# Altium schematic sheet Sheet1.SchDoc
size A3; SheetNumber: 1; SheetTotal: 1
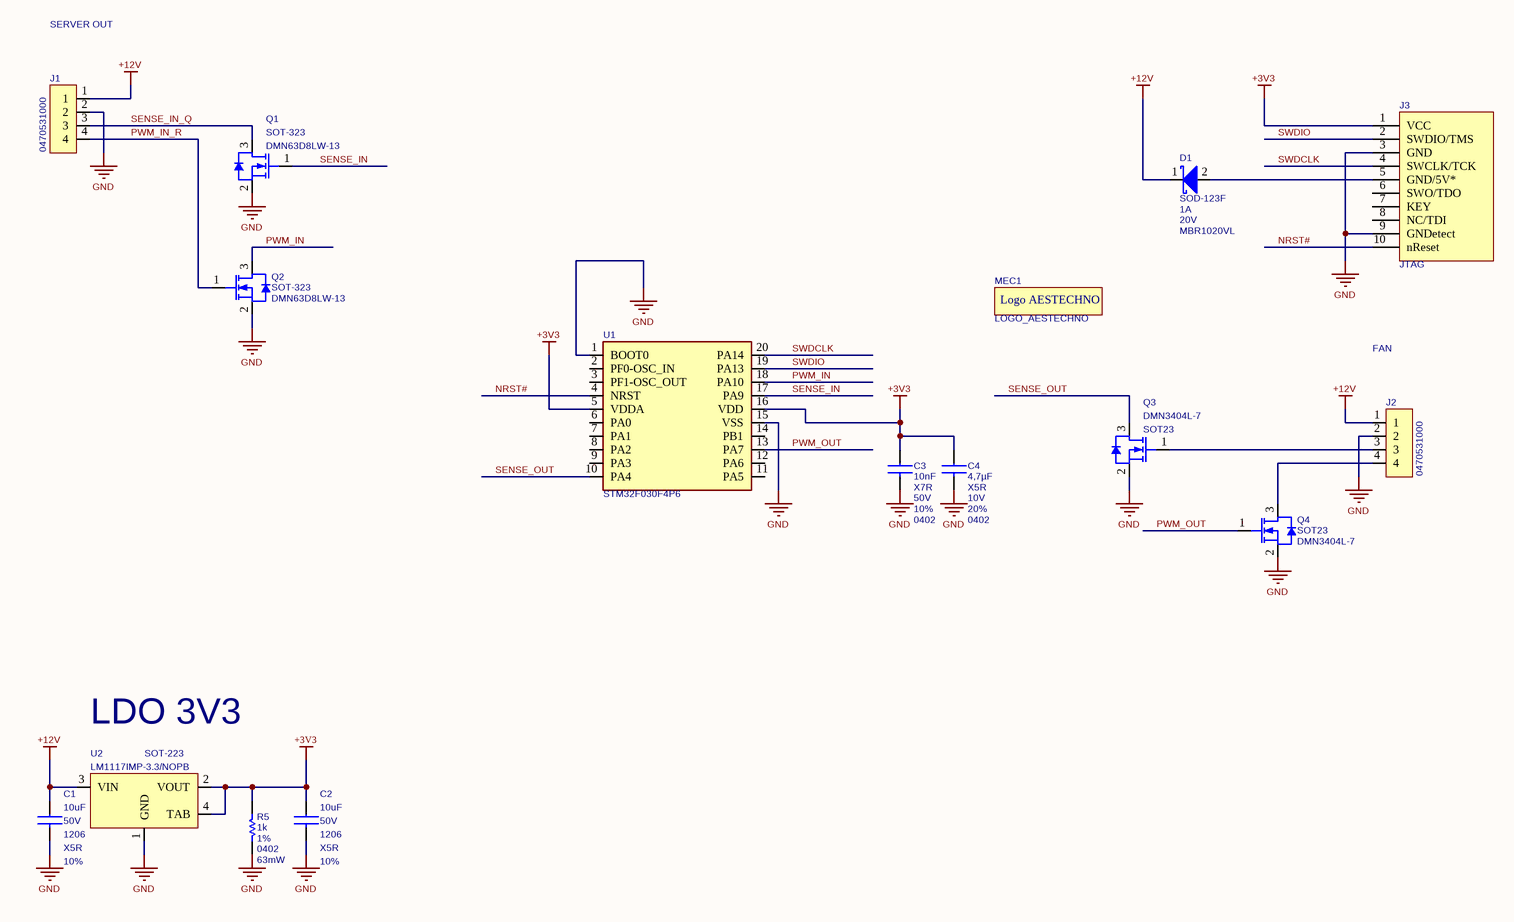
[diagram p0: Sheet1.SchDoc]

## Parts
C1  10uF  Tolerance: 10%  Voltage Rating: 50V  Dielectric: X5R  Case/Package: 1206  [CAP_1206_180_M]
C2  10uF  Tolerance: 10%  Voltage Rating: 50V  Dielectric: X5R  Case/Package: 1206  [CAP_1206_180_M]
C3  10nF  Dielectric: X7R  Voltage: 50V  Tolerance: 10%  Case/Package: 0402  [CAP_0402_60_M]
C4  4,7µF  Dielectric: X5R  Voltage: 10V  Tolerance: 20%  Case/Package: 0402  [CAP_0402_70_M]
D1  SOD-123F  Average Rectified Current: 1A  Max Repetitive Reverse Voltage (Vrrm): 20V  Manufacturer Part Number: MBR1020VL  [SOD-123FL]
J1  Manufacturer Part Number: 0470531000  [CON_4PTS_KK_FAN]  (hidden comment: CON_4PTS_2.54mm_KK_FAN)
J2  Manufacturer Part Number: 0470531000  [CON_4PTS_KK_FAN]  (hidden comment: CON_4PTS_2.54mm_KK_FAN)
J3  JTAG  [TC2050_DUAL]  (no BOM)
MEC1  LOGO_AESTECHNO  [Logo_AESTECHNO]  (no BOM)
Q1  SOT-323  Manufacturer Part Number: DMN63D8LW-13  [SOT-323]
Q2  SOT-323  Manufacturer Part Number: DMN63D8LW-13  [SOT-323]
Q3  SOT23  Manufacturer Part Number: DMN3404L-7  [SOT-23]
Q4  SOT23  Manufacturer Part Number: DMN3404L-7  [SOT-23]
R5  1k  Tolerance: 1%  Case/Package: 0402  Power Rating: 63mW  [RES_0402_35_M]
U1  STM32F030F4P6  [TSSOP20-65P-650X440]
U2  LM1117IMP-3.3/NOPB  [SOT-223]

## Nets
+3V3: C2.1 C3.1 C4.1 J3.1(VCC) R5.2(P2) U1.5(VDDA) U1.16(VDD) U2.2(VOUT) U2.4(TAB)
+12V: C1.1 D1.1(K) J1.1 J2.1 U2.3(VIN)
GND: C1.2 C2.2 C3.2 C4.2 J1.2 J2.2 J3.3(GND) J3.9(GNDetect) Q1.2(S) Q2.2(S) Q3.2(S) Q4.2(S) R5.1(P1) U1.1(BOOT0) U1.15(VSS) U2.1(GND)
NRST#: J3.10(nReset) U1.4(NRST)
PWM_IN: Q2.3(D) U1.18(PA10)
PWM_IN_R: J1.4 Q2.1(G)
PWM_OUT: Q4.1(G) U1.13(PA7)
SENSE_IN: Q1.1(G) U1.17(PA9)
SENSE_IN_Q: J1.3 Q1.3(D)
SENSE_OUT: Q3.3(D) U1.10(PA4)
SWDCLK: J3.4(SWCLK/TCK) U1.20(PA14)
SWDIO: J3.2(SWDIO/TMS) U1.19(PA13)
NetD1_2: D1.2(A) J3.5(GND/5V*)
NetJ2_3: J2.3 Q3.1(G)
NetJ2_4: J2.4 Q4.3(D)

Not connected (* = marked no-connect by the designer): J3 6(SWO/TDO) 7(KEY) 8(NC/TDI); U1 2(PF0-OSC_IN) 3(PF1-OSC_OUT) 6(PA0) 7(PA1) 8(PA2) 9(PA3) 11(PA5) 12(PA6) 14(PB1)

## Notes on the sheet
- SERVER OUT
- FAN
- LDO 3V3
- Title
- Size:
- Date:
- A3
- Number:
- Time:
- Revision:
- Sheet
- of
- File:
- (in symbol LOGO_AESTECHNO) Logo AESTECHNO

## Library data of the parts
C1 C2 = CAP_10uF_1206_50V_X5R: CAP CER 10uF 50V 1206 X5R; Manufacturer: Samsung; Manufacturer Part Number: CL31A106KBHNNNE; Material: Ceramic; Supplier 1: Digi-Key; RoHS: Yes; Stock 1: 1003545; Pricing 1: 1 = 0,67000, 10 = 0,47700, 100 = 0,31420, 500 = 0,23276, 1000 = 0,19784 (USD); Mount: Surface Mount; Case Code (Metric): 3216; Case Code (Imperial): 1206; Contact Plating: Tin; Min Operating Temperature: -55°C; Max Operating Temperature: 85°C; Package Quantity: 1; Packaging: Tape and Reel; Voltage Rating (DC): 50V; Length: 3.2mm; Height: 1.6mm; Width: 0.063inch; Thickness: 0.071inch; Depth: 1.6mm; Radiation Hardening: No; Lead Free: Lead Free; ComponentLink1URL: https://media.digikey.com/pdf/Data%20Sheets/Samsung%20PDFs/CL_Series_MLCC_ds.pdf; ComponentLink1Description: Datasheet; ComponentLink2URL: http://www1.futureelectronics.com/doc/SAMSUNG%20PASSIVE/CL05B104KQ5NNNC.pdf; ComponentLink2Description: http://www1.futureelectronics.com/doc/SAMSUNG%20PASSIVE/CL05B104KQ5NNNC.pdf; ComponentLink3URL: http://www.rapidonline.com/pdf/71-0881.pdf; ComponentLink3Description: http://www.rapidonline.com/pdf/71-0881.pdf; ComponentLink4URL: https://www.verical.com/server-webapp/html/getDatasheet?partID=353196; ComponentLink4Description: https://www.verical.com/server-webapp/html/getDatasheet?partID=353196; ComponentLink5URL: https://produktinfo.conrad.com/datenblaetter/450000-474999/452492-da-01-en-VS_KONDENSATOR_1206.pdf; ComponentLink5Description: https://produktinfo.conrad.com/datenblaetter/450000-474999/452492-da-01-en-VS_KONDENSATOR_1206.pdf; Supplier Part Number 1: 1276-2876-1-ND; Capacitance: 10uF
C3 = CAP_10nF_0402_50V_X7R: CAP CER 10nF 50V 0402 X7R; Manufacturer: Samsung; Manufacturer Part Number: CL05B103KB5NNNC; Material: Ceramic; Supplier 1: Digi-Key; Supplier Part Number 1: 1276-1028-1-ND; Stock 1: 10927176; Pricing 1: 1 = 0,10000, 10 = 0,02300, 100 = 0,01020, 500 = 0,00726, 1000 = 0,00571, 2500 = 0,00519, 5000 = 0,00477 (USD); RoHS: Yes; Mount: Surface Mount; Case Code (Metric): 1005; Case Code (Imperial): 0402; Contact Plating: Tin; Min Operating Temperature: -55°C; Max Operating Temperature: 125°C; Capacitance: 10nF; Packaging: Tape and Reel; Package Quantity: 1; Voltage Rating: 50V; Voltage Rating (DC): 50V; Length: 1mm; Height: 0.5mm; Width: 0.02inch; Thickness: 0.022inch; Depth: 0.5mm; Radiation Hardening: No; Lead Free: Lead Free; ComponentLink1URL: https://www.verical.com/server-webapp/html/getDatasheet?partID=359682&src-supplier=Verical; ComponentLink1Description: Datasheet; ComponentLink2URL: https://www.distrelec.biz/Web/Downloads/_e/ng/MLCC_CatalogDownload2013_ENG.pdf?mime=application%2Fpdf&src-supplier=Distrelec; ComponentLink2Description: https://www.distrelec.biz/Web/Downloads/_e/ng/MLCC_CatalogDownload2013_ENG.pdf?mime=application%2Fpdf&src-supplier=Distrelec; ComponentLink3URL: https://produktinfo.conrad.com/datenblaetter/450000-474999/458761-da-01-en-VS_KONDENSATOR_0402.pdf?src-supplier=Conrad; ComponentLink3Description: https://produktinfo.conrad.com/datenblaetter/450000-474999/458761-da-01-en-VS_KONDENSATOR_0402.pdf?src-supplier=Conrad
C4 = CAP_4.7uF_0402_10V_X5R: CAP CER 4.7uF 10V X5R 0402; Manufacturer: Murata; Manufacturer Part Number: GRM155R61A475MEAAD; ComponentLink1URL: https://datasheet.ciiva.com/144/docfinderpartnumber-c0402c470j5gactu-144106.pdf?src-supplier=Digi-Key; ComponentLink1Description: https://datasheet.ciiva.com/144/docfinderpartnumber-c0402c470j5gactu-144106.pdf?src-supplier=Digi-Key; ComponentLink2URL: https://datasheet.ciiva.com/18100/getdatasheetpartid-32341-18100871.pdf?src-supplier=Verical; ComponentLink2Description: https://datasheet.ciiva.com/18100/getdatasheetpartid-32341-18100871.pdf?src-supplier=Verical; ComponentLink3URL: https://datasheet.ciiva.com/7378/1372242-7378762.pdf?src-supplier=Newark; ComponentLink3Description: https://datasheet.ciiva.com/7378/1372242-7378762.pdf?src-supplier=Newark; ComponentLink4URL: https://datasheet.ciiva.com/7747/f9080b-0402-series-c0g-7747645.pdf?src-supplier=Element14; ComponentLink4Description: https://datasheet.ciiva.com/7747/f9080b-0402-series-c0g-7747645.pdf?src-supplier=Element14; ComponentLink5URL: https://datasheet.ciiva.com/14588/70095383-14588206.pdf?src-supplier=Allied+Electronics; ComponentLink5Description: https://datasheet.ciiva.com/14588/70095383-14588206.pdf?src-supplier=Allied+Electronics; ComponentLink6URL: https://datasheet.ciiva.com/7747/40889-7747541.pdf?src-supplier=Element14; ComponentLink6Description: https://datasheet.ciiva.com/7747/40889-7747541.pdf?src-supplier=Element14; ComponentLink7URL: https://datasheet.ciiva.com/6177/f9080b-0402-series-c0g-6177898.pdf?src-supplier=Farnell; ComponentLink7Description: https://datasheet.ciiva.com/6177/f9080b-0402-series-c0g-6177898.pdf?src-supplier=Farnell; ComponentLink8URL: https://datasheet.ciiva.com/7378/1372242-7378507.pdf?src-supplier=Newark; ComponentLink8Description: https://datasheet.ciiva.com/7378/1372242-7378507.pdf?src-supplier=Newark; ComponentLink9URL: https://datasheet.ciiva.com/14602/70095383-14602972.pdf?src-supplier=Allied+Electronics; ComponentLink9Description: https://datasheet.ciiva.com/14602/70095383-14602972.pdf?src-supplier=Allied+Electronics; ComponentLink10URL: https://datasheet.ciiva.com/5422/kem-c1003-c0g-smd-5422301.pdf?src-supplier=Mouser; ComponentLink10Description: https://datasheet.ciiva.com/5422/kem-c1003-c0g-smd-5422301.pdf?src-supplier=Mouser; Supplier 1: Digi-Key; Supplier Part Number 1: 490-14306-1-ND; Stock 1: 680935; Pricing 1: 1 = 0,23000, 10 = 0,15400, 100 = 0,07780, 500 = 0,05322, 1000 = 0,04708, 2500 = 0,04504, 5000 = 0,04094 (USD); ComponentLink11URL: http://www.farnell.com/datasheets/2189109.pdf?src-supplier=Farnell; ComponentLink11Description: http://www.farnell.com/datasheets/2189109.pdf?src-supplier=Farnell; ComponentLink12URL: http://search.murata.co.jp/Ceramy/image/img/A01X/G101/ENG/GRM155R61A475MEAA-01.pdf?src-supplier=Digi-Key; ComponentLink12Description: http://search.murata.co.jp/Ceramy/image/img/A01X/G101/ENG/GRM155R61A475MEAA-01.pdf?src-supplier=Digi-Key; ComponentLink13URL: https://search.murata.co.jp/Ceramy/image/img/A01X/G101/ENG/GRM155R61A475MEAA-01.pdf?src-supplier=Digi-Key; ComponentLink13Description: https://search.murata.co.jp/Ceramy/image/img/A01X/G101/ENG/GRM155R61A475MEAA-01.pdf?src-supplier=Digi-Key; ComponentLink14URL: http://datasheet.octopart.com/GRM155R61A475MEAAD-Murata-datasheet-68589269.pdf?src-supplier=Newark; ComponentLink14Description: http://datasheet.octopart.com/GRM155R61A475MEAAD-Murata-datasheet-68589269.pdf?src-supplier=Newark; ComponentLink15URL: http://datasheet.octopart.com/GRM155R61A475MEAAD-Murata-datasheet-8819587.pdf; ComponentLink15Description: http://datasheet.octopart.com/GRM155R61A475MEAAD-Murata-datasheet-8819587.pdf; ComponentLink16URL: http://datasheet.octopart.com/GRM155R61A475MEAAD-Murata-datasheet-10025737.pdf; ComponentLink16Description: http://datasheet.octopart.com/GRM155R61A475MEAAD-Murata-datasheet-10025737.pdf; ComponentLink17URL: http://datasheet.octopart.com/GRM155R61A475MEAAD-Murata-datasheet-11978611.pdf; ComponentLink17Description: http://datasheet.octopart.com/GRM155R61A475MEAAD-Murata-datasheet-11978611.pdf; ComponentLink18URL: http://datasheet.octopart.com/GRM155R61A475MEAAD-Murata-datasheet-12510076.pdf; ComponentLink18Description: http://datasheet.octopart.com/GRM155R61A475MEAAD-Murata-datasheet-12510076.pdf; ComponentLink19URL: http://datasheet.octopart.com/GRM155R61A475MEAAD-Murata-datasheet-12515295.pdf; ComponentLink19Description: http://datasheet.octopart.com/GRM155R61A475MEAAD-Murata-datasheet-12515295.pdf; Capacitance: 4,7µF
D1 = DIO_SCHOTTKY_1A_20V_SOD_123F: DIODE SCHOTTKY 20V 1A SOD-123F; Manufacturer: ON Semiconductor / Fairchild; Reverse Recovery Time: 12.4ns; Element Configuration: Single; Max Forward Surge Current (Ifsm): 45A; ComponentLink1Description: Datasheet; ComponentLink1URL: https://datasheet.octopart.com/MBR1020VL-ON-Semiconductor-datasheet-86697812.pdf; Stock 1: 25209; Pricing 1: 1 = 0,380000, 10 = 0,279000, 100 = 0,158200, 500 = 0,104760, 1000 = 0,080320 (USD); RoHS: Yes; Mount: Surface Mount; Weight: 0.0276g; Packaging: Tape and Reel; Max Reverse Voltage (DC): 20V; ComponentLink2URL: http://www.farnell.com/datasheets/2552643.pdf?src-supplier=Farnell; ComponentLink2Description: http://www.farnell.com/datasheets/2552643.pdf?src-supplier=Farnell; ComponentLink3URL: https://www.fairchildsemi.com/datasheets/MB/MBR1020VL.pdf?src-supplier=Digi-Key; ComponentLink3Description: https://www.fairchildsemi.com/datasheets/MB/MBR1020VL.pdf?src-supplier=Digi-Key; ComponentLink4URL: http://www.farnell.com/datasheets/2552643.pdf?src-supplier=Newark; ComponentLink4Description: http://www.farnell.com/datasheets/2552643.pdf?src-supplier=Newark; Case/Package: SOD-123F; Supplier 1: Digi-Key; Supplier 2: Digi-Key; Supplier Part Number 1: MBR1020VLCT-ND; Supplier Part Number 2: 1514-CMMSH1-20GTRPBFREECT-ND
J1 J2 = CON_4PTS_2.54mm_KK_FAN: CONN HEADER VERT 4POS 2.54MM; Manufacturer: Molex; Number of Positions: 4; Connector Type: Male Pin; ComponentLink1Description: Drawings; ComponentLink1URL: https://www.molex.com/pdm_docs/sd/470531000_sd.pdf; Supplier 1: Digi-Key; Supplier Part Number 1: WM4330-ND; Stock 1: 41699; RoHS: Yes; Mount: Through Hole; Contact Plating: Tin; Contact Material: Brass,Copper Alloy; Housing Color: Beige; Housing Material: Nylon; Color: Beige; Min Operating Temperature: 0°C; Max Operating Temperature: 75°C; Packaging: Bulk; Number of Rows: 1; Termination: Solder; Number of Contacts: 4; Orientation: Straight; Fastening Type: Friction; Length: 10.2mm; Pitch: 2.54mm; Depth: 5.84mm; Contact Mating Length: 0.295inch
J3 = TC2050_DUAL: JTAG CONNECTOR; ComponentLink1Description: Datasheet
MEC1 = LOGO_AESTECHNO: LOGO AESTECNO
Q1 Q2 = TRS_NMOS_30V_0.38A_DMN63D8LW-13: MOSFET N-CH 30V 0.38A SOT323; Manufacturer: Diodes; Continuous Drain Current (ID): 380mA; Rds On Max: 2.8R; Input Capacitance: 23.2pF; Max Power Dissipation: 300mW; ComponentLink1Description: Datasheet; ComponentLink1URL: https://www.diodes.com/assets/Datasheets/DMN63D8LW.pdf; Supplier 1: Digi-Key; Supplier Part Number 1: DMN63D8LW-13DICT-ND; Stock 1: 214518; Pricing 1: 1=0,26000, 10=0,24100, 100=0,13480, 500=0,07222, 1000=0,04912 (USD); RoHS: Yes; Mount: Surface Mount; Min Operating Temperature: -55°C; Max Operating Temperature: 150°C; Packaging: Tape and Reel; Drain to Source Voltage (Vdss): 30V; Case/Package: SOT-323
Q3 Q4 = TRS_NMOS_30V_5.8AA_DMN3404L-7_SOT23: Small Signal Field-Effect Transistor; Manufacturer: Diodes; Package Body Material: Plastic; Transistor Element Material: SILICON; Polarity/Channel Type: N-CHANNEL; Additional Feature: HIGH RELIABILITY; Drain Current-Max (Abs) (ID): 5.8A; Drain-source On Resistance-Max: 28mR; DS Breakdown Voltage-Min: 30V; FET Technology: METAL-OXIDE SEMICONDUCTOR; Number of Elements: 1; Operating Mode: ENHANCEMENT MODE; Power Dissipation-Max (Abs): 1.4W; Pulsed Drain Current-Max (IDM): 30A; Time @ Peak Reflow Temperature-Max (s): 40s; Transistor Application: SWITCHING; Qualification Status: Not Qualified; ComponentLink1Description: Datasheet; ComponentLink1URL: https://www.diodes.com/assets/Datasheets/DMN63D8LW.pdf; Supplier: Digikey; Supplier Part Number: DMN3404LDICT-ND; RoHS: Yes; Category: MOSFETs; Stock: 79423; Pricing: 1=0.35, 10=0.211, 100=0.1326, 500=0.09838, 1000=0.08729 (USD); Pins: 3; Package Shape: Rectangular; Terminal Finish: Tin; Max Operating Temperature: 150°C; JESD-609 Code: e3; Drain Current-Max (ID): 5.8A; JESD-30 Code: R-PDSO-G3; Moisture Sensitivity Level: 1; Package Style: SMALL OUTLINEMeter; Peak Reflow Temperature (Cel): 260°C; Surface Mount: Yes; Terminal Form: Gull Wing; Terminal Position: DUAL; Reach SVHC Compliant: Yes; RoHS Compliant: Yes; Case/Package: SOT23
R5 = RES_1K_62.5mW_1%_0402: RES 1k 62.5mW 1% 0402; Manufacturer: Yageo; Manufacturer Part Number: RC0402FR-071KL; Temperature Coefficient: 100ppm/°C; Voltage Rating (DC): 50V; Supplier 1: Digi-Key; Supplier Part Number 1: 311-1.00KLRCT-ND; Stock 1: 111913296; Pricing 1: 1 = 0,10000, 10 = 0,01600, 100 = 0,00670, 1000 = 0,00301, 2500 = 0,00261, 5000 = 0,00215 (USD); RoHS: Yes; Number of Pins: 2; Case Code (Imperial): 0402; Case Code (Metric): 1005; Min Operating Temperature: -55°C; Max Operating Temperature: 155°C; Resistance: 1k; Composition: Thick Film; Packaging: Tape and Reel; Voltage Rating: 50V; Termination: SMD/SMT; Military Standard: Not; Length: 1mm; Height: 0.32mm; Width: 0.5mm; Depth: 0.5mm; REACH SVHC: Unknown; Lead Free: Lead Free; ComponentLink1URL: http://documents.rs-components.com/techlib://itc_doclist_GB.htm?stockno=6186122&src-supplier=RSComponents; ComponentLink1Description: http://documents.rs-components.com/techlib://itc_doclist_GB.htm?stockno=6186122&src-supplier=RSComponents; ComponentLink2URL: http://www.mouser.com/ds/2/447/PYu-RC0402_51_RoHS_L_6_r-8721.pdf?src-supplier=Mouser; ComponentLink2Description: http://www.mouser.com/ds/2/447/PYu-RC0402_51_RoHS_L_6_r-8721.pdf?src-supplier=Mouser; ComponentLink3URL: http://www.yageo.com/documents/recent/PYu-RC0402_51_RoHS_L_6_r.pdf?src-supplier=Future+Electronics; ComponentLink3Description: http://www.yageo.com/documents/recent/PYu-RC0402_51_RoHS_L_6_r.pdf?src-supplier=Future+Electronics; ComponentLink4URL: http://www.farnell.com/datasheets/1018594.pdf?src-supplier=Element14; ComponentLink4Description: http://www.farnell.com/datasheets/1018594.pdf?src-supplier=Element14; ComponentLink5URL: http://www.farnell.com/datasheets/2167052.pdf?src-supplier=Element14; ComponentLink5Description: http://www.farnell.com/datasheets/2167052.pdf?src-supplier=Element14
U1 = STM32F030F4P6: ARM® Cortex®-M0 STM32F0 Microcontroller IC 32-Bit Single-Core 48MHz 16KB (16K x 8) FLASH 20-TSSOP; Manufacturer_Name: ST; Manufacturer_Part_Number: STM32F030F4P6TR; PartNumber: 1000044559; Rev: A
U2 = CIN_REG_LDO_3V3_800mA_SOT-223: REG LDO 3V3 800mA; Manufacturer: Texas Instruments; Manufacturer Part Number: LM1117IMPX-3.3/NOPB; Output Voltage: 3.3V; Max Input Voltage: 15V; Number of Outputs: 1; Polarity: Positive; Quiescent Current: 5mA; Accuracy: 1%; Output Type: Fixed; Dropout Voltage: 1.2V; Min Input Voltage: 2.6V; ComponentLink1Description: Datasheet; ComponentLink1URL: http://www.ti.com/lit/ds/symlink/lm1117.pdf; Supplier 1: Digi-Key; Supplier Part Number 1: LM1117IMPX-3.3/NOPBCT-ND; Stock 1: 34433; Pricing 1: 1 = 1,14000, 10 = 1,01500, 100 = 0,79120, 500 = 0,65364, 1000 = 0,51603 (USD); RoHS: Yes; Mount: Surface Mount; Number of Pins: 4; Contact Plating: Matte,Tin; Min Operating Temperature: -40°C; Max Operating Temperature: 125°C; Max Output Current: 800mA; Nominal Output Voltage: 3.3V; Output Current: 800mA; Packaging: Tape and Reel; Output Voltage Accuracy: 1%; REACH SVHC: No SVHC; Lead Free: Lead Free; ComponentLink2URL: http://www.farnell.com/datasheets/1882372.pdf?src-supplier=Element14; ComponentLink2Description: http://www.farnell.com/datasheets/1882372.pdf?src-supplier=Element14; Case/Package: SOT-223